# EAGLE design RotEncoder (EAGLE 9.4.1)
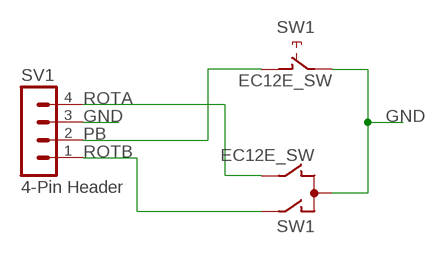
[diagram p0: schematic, sheet 1]

## Parts
SV1  4-Pin Header  HEADER04-1  [HEADER04-1]
SW1  EC12E_SW  [ALPS_EC12E_SW]

## Nets
GND: SV1.3 SW1.C SW1.E
PB: SV1.2 SW1.D
ROTA: SV1.4 SW1.B
ROTB: SV1.1 SW1.A
Unconnected: SW1.GND1(G) SW1.GND2(G)

## Library data of the parts
SV1 = LBussy:HEADER04-1: PIN HEADER; OC_FARNELL: unknown; OC_NEWARK: unknown
SW1 = switch-alps:EC12E_SW: ALPS rotary Encoder EC12E series with switch; MPN: EC12E2424407; OC_FARNELL: 1520813; OC_NEWARK: 74M1068

## Board
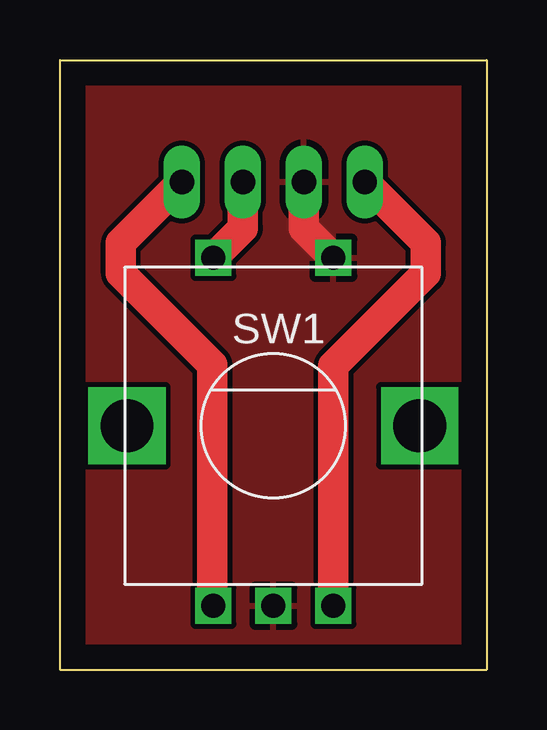
[diagram p1: board, top side]
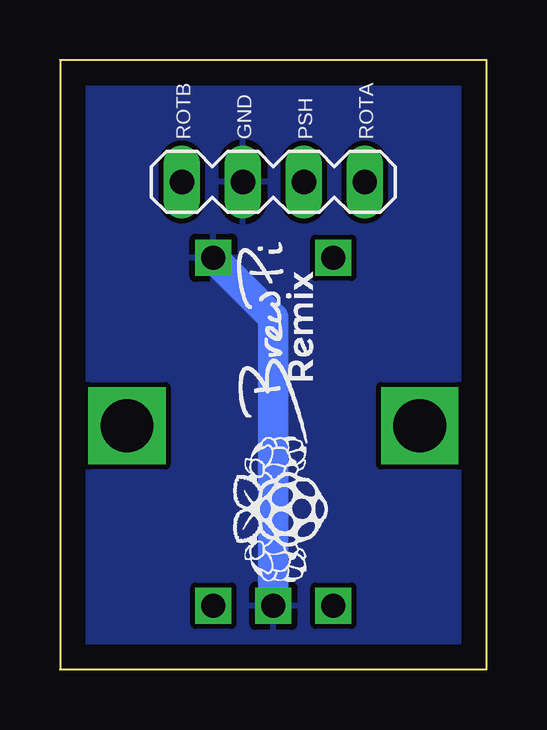
[diagram p2: board, bottom side, seen from below]

Size 17.78 x 25.4 mm. Coordinates in mm from the lower left corner, seen from the top.
Outline: 0,0 0,25.4 17.78,25.4 17.78,0 0,0
Copper layers (1*16): Top 0.035mm / dielectric 1.5mm / Bottom 0.035mm
Design rules "default *": minimum track width 6mil, minimum drill 0.35mm, track to track 8mil, track to pad 8mil, pad to pad 8mil, via to via 8mil, smd to smd 8mil, copper to edge 40mil, drill to drill 6mil, minimum pad ring 10mil, minimum via ring 8mil, stop-mask expansion 4mil, vias tented up to drill 0mil, thermal gap 10mil

### Footprints (pad centres in the part's own frame; a part is rotated, then mirrored left to right if it is on the bottom)
HEADER04-1 = drill 1.016 long: 1 -3.81,0; 2 -1.27,0; 3 1.27,0; 4 3.81,0
ALPS_EC12E_SW = drill 1 square: A -2.5,-7.5; B 2.5,-7.5; C 0,-7.5; D -2.5,7; E 2.5,7 | drill 2.2 square: GND1 -6.1,0; GND2 6.1,0

### Placement (x,y rotation side)
SV1  8.89,20.32 180 bottom
SW1  8.89,10.16 0 top

### Tracks (layer width: path | path; a pad name or v marks a point on that pad's centre or on a via)
GND
  Top 1.27: SW1.E 10.16,18.39 SV1.3
  Bottom 1.27: SW1.C 8.89,14.66 SW1.E
  pour Top: 18.26,25.72 18.3,25.69 18.3,-0.25 -0.2,-0.25 -0.2,25.69
  pour Bottom: 18.14,25.72 18.19,25.78 18.19,-0.31 18.14,-0.36 0.04,-0.36 -0.07,-0.25 -0.07,25.63 0.04,25.74
PB
  Top 1.27: SW1.D 7.62,18.39 SV1.2
ROTA
  Top 1.27: SW1.B 11.39,12.66 15.24,16.51 15.24,17.78 SV1.4
ROTB
  Top 1.27: SW1.A 6.35,2.7 6.35,12.7 2.54,16.51 2.54,17.78 SV1.1

### Text on the board
bNames: ROTA | PSH | GND | ROTB